# EAGLE design JTAG (EAGLE 6.5.0)
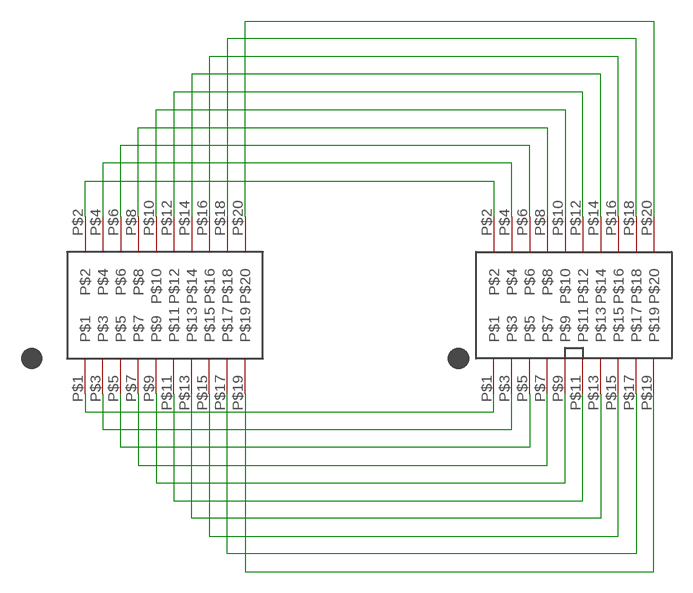
[diagram p0: schematic, sheet 1]

## Parts
U$1  MOLEX54722-0304  [MOLEX054722-0304]
U$2  2X10JTAG  [2X10JTAG]

## Nets
N$1: U$1.P$20 U$2.P$20
N$2: U$1.P$18 U$2.P$18
N$3: U$1.P$16 U$2.P$16
N$4: U$1.P$14 U$2.P$14
N$5: U$1.P$12 U$2.P$12
N$6: U$1.P$10 U$2.P$10
N$7: U$1.P$8 U$2.P$8
N$8: U$1.P$6 U$2.P$6
N$9: U$1.P$5 U$2.P$5
N$10: U$1.P$4 U$2.P$4
N$11: U$1.P$2 U$2.P$2
N$12: U$1.P$1 U$2.P$1
N$13: U$1.P$3 U$2.P$3
N$14: U$1.P$7 U$2.P$7
N$15: U$1.P$9 U$2.P$9
N$16: U$1.P$11 U$2.P$11
N$17: U$1.P$13 U$2.P$13
N$18: U$1.P$15 U$2.P$15
N$19: U$1.P$17 U$2.P$17
N$20: U$1.P$19 U$2.P$19

## Library data of the parts
U$1 = KW2:MOLEX54722-0304; MFGN: MOLEX; MFGP: 54722-0304
U$2 = KW2:2X10JTAG

## Board
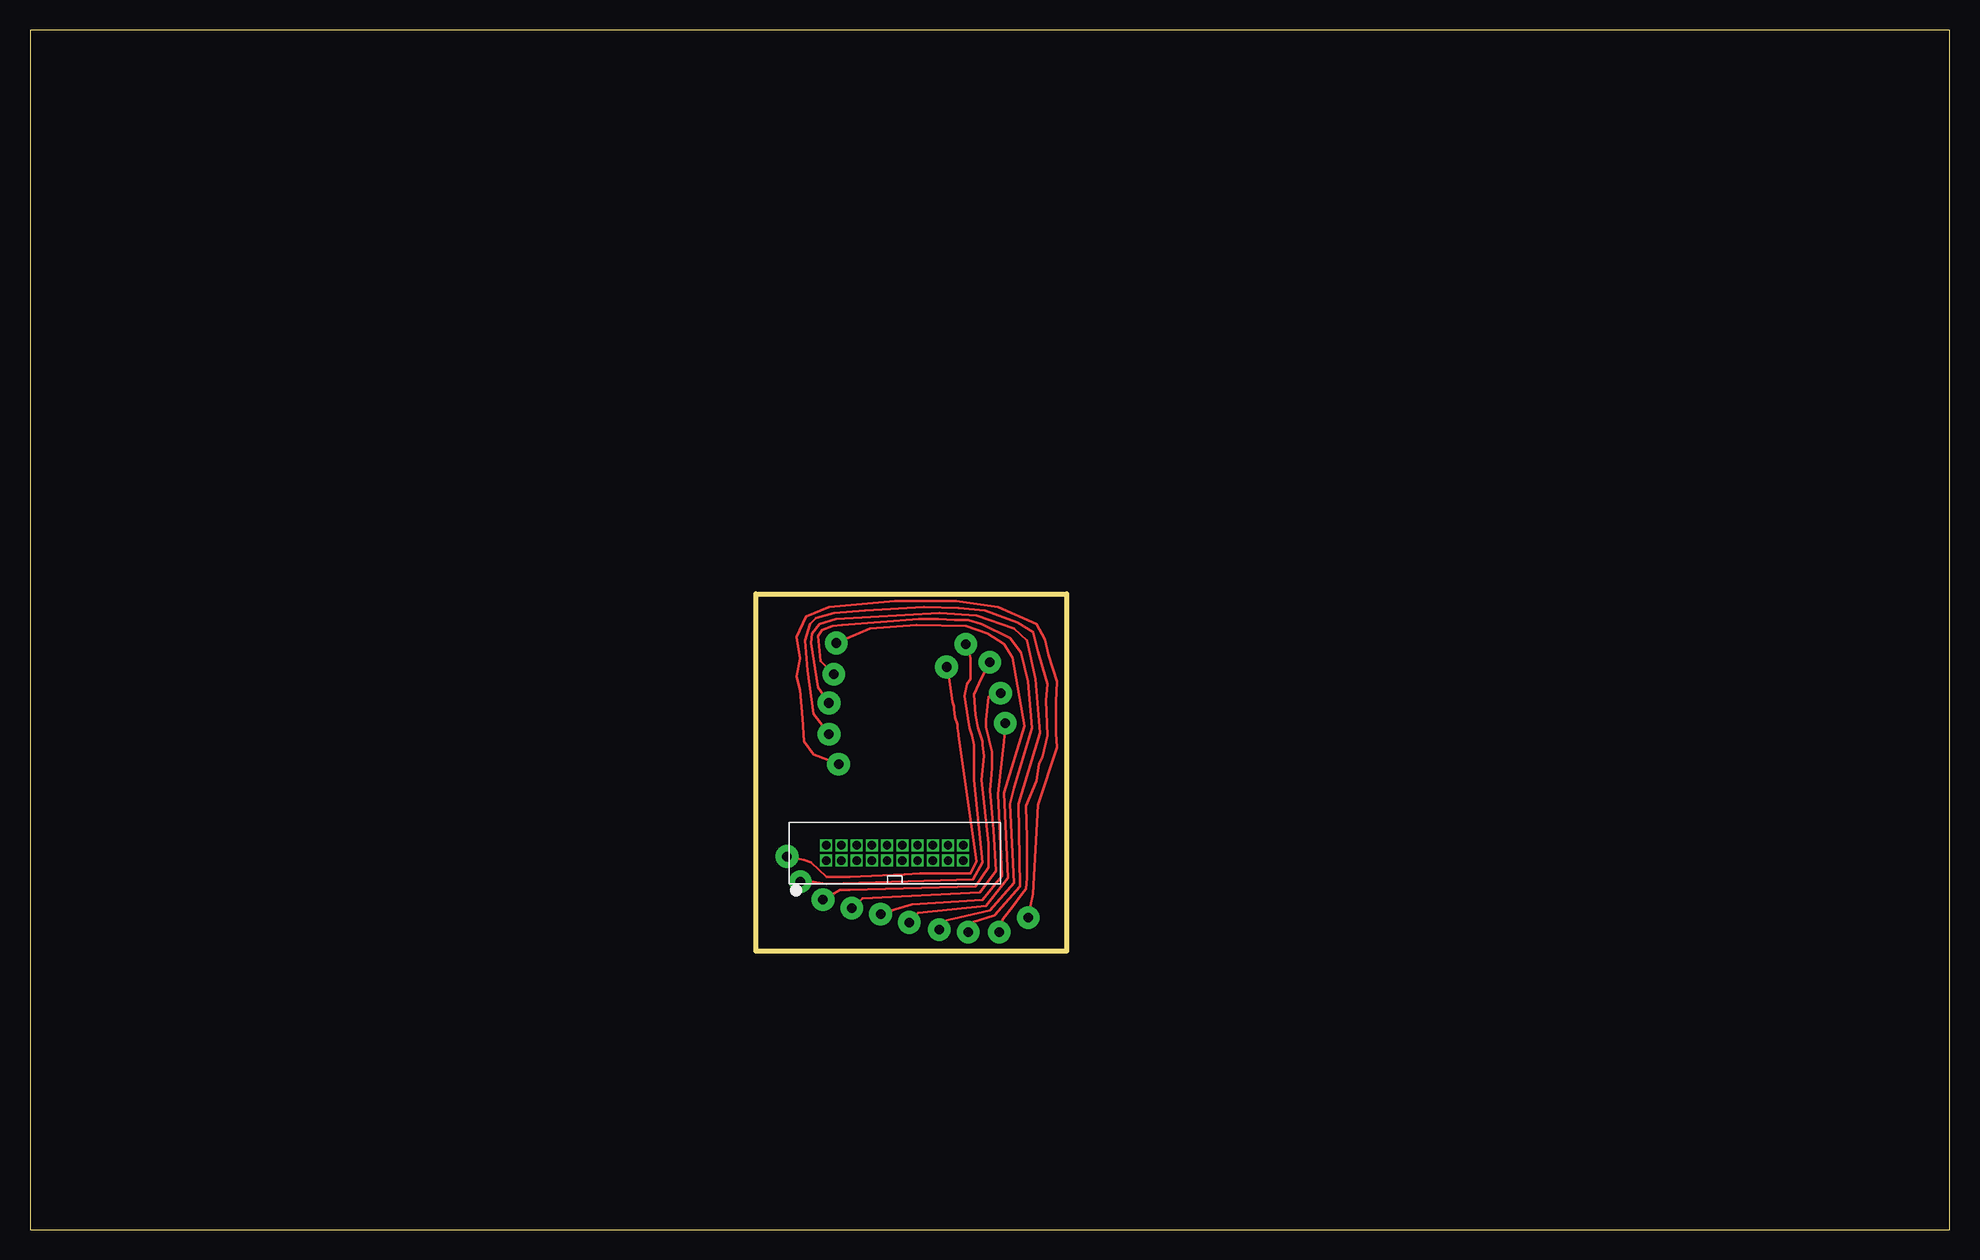
[diagram p1: board, top side]
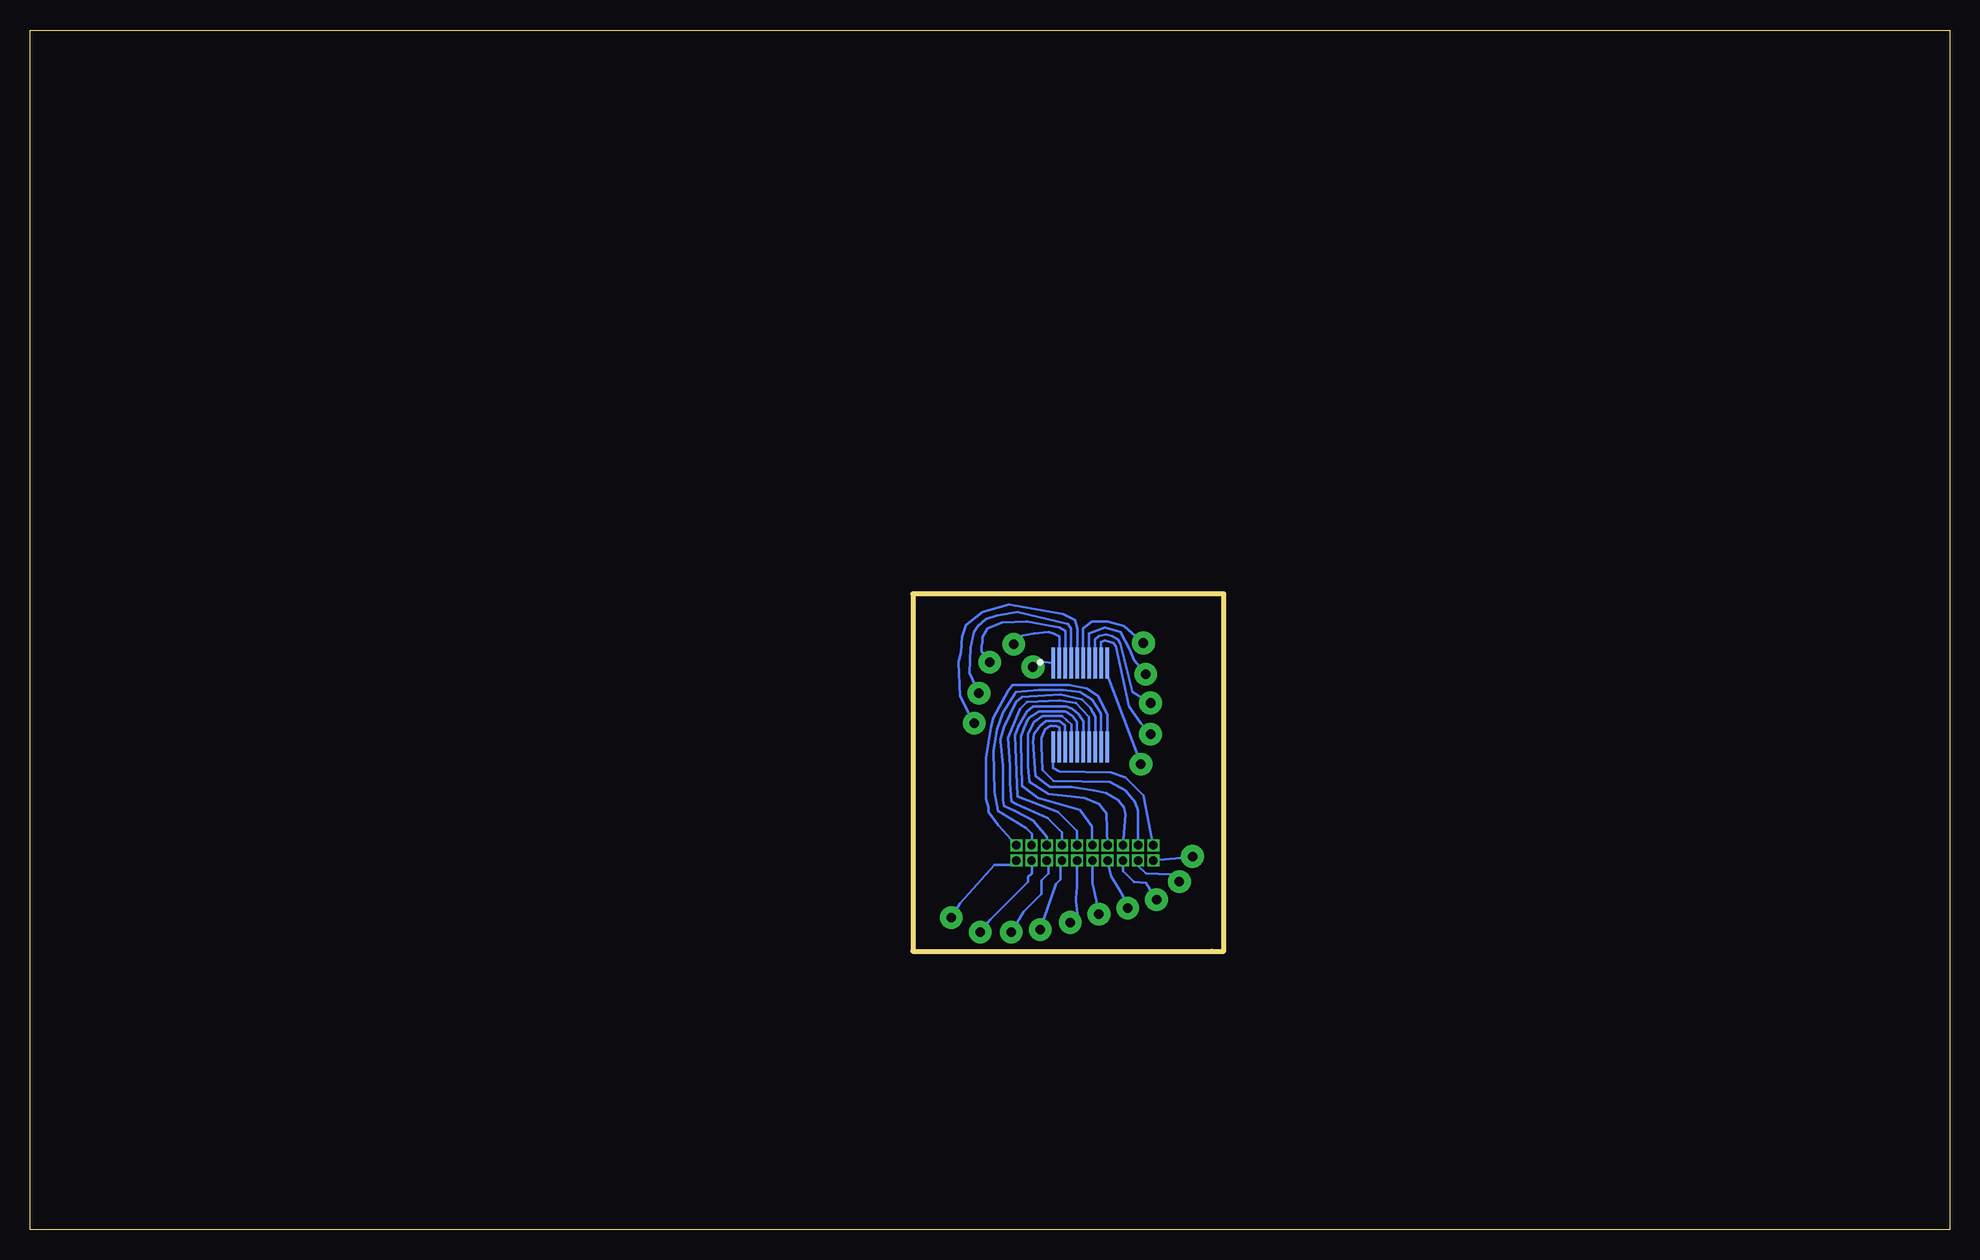
[diagram p2: board, bottom side, seen from below]

Size 160 x 100 mm. Coordinates in mm from the lower left corner, seen from the top.
Outline: 0,0 160,0 160,100 0,100 0,0
Outline: 60.5,53 86.4,53 86.4,23.2 61.5,23.2 60.5,23.2 60.5,53
Copper layers (1*16): Top 0.035mm / dielectric 1.5mm / Bottom 0.035mm
Design rules "default *": minimum track width 2mil, minimum drill 24mil, track to track 0.2mm, track to pad 0.2mm, pad to pad 0.2mm, via to via 0.2mm, smd to smd 0.2mm, copper to edge 40mil, drill to drill 8mil, minimum pad ring 1mil, minimum via ring 1mil, stop-mask expansion 4mil, vias tented up to drill 0mil, thermal gap 10mil

### Footprints (pad centres in the part's own frame; a part is rotated, then mirrored left to right if it is on the bottom)
MOLEX054722-0304 = smd 0.3 x 2.6: P$1 2.25,-3.5; P$2 2.25,3.5; P$3 1.75,-3.5; P$4 1.75,3.5; P$5 1.25,-3.5; P$6 1.25,3.5; P$7 0.75,-3.5; P$8 0.75,3.5; P$9 0.25,-3.5; P$10 0.25,3.5; P$11 -0.25,-3.5; P$12 -0.25,3.5; P$13 -0.75,-3.5; P$14 -0.75,3.5; P$15 -1.25,-3.5; P$16 -1.25,3.5; P$17 -1.75,-3.5; P$18 -1.75,3.5; P$19 -2.25,-3.5; P$20 -2.25,3.5
2X10JTAG = drill 0.7 pad 1 square: P$1 -6.35,-1.27; P$2 -6.35,0; P$3 -5.08,-1.27; P$4 -5.08,0; P$5 -3.81,-1.27; P$6 -3.81,0; P$7 -2.54,-1.27; P$8 -2.54,0; P$9 -1.27,-1.27; P$10 -1.27,0; P$11 0,-1.27; P$12 0,0; P$13 1.27,-1.27; P$14 1.27,0; P$15 2.54,-1.27; P$16 2.54,0; P$17 3.81,-1.27; P$18 3.81,0; P$19 5.08,-1.27; P$20 5.08,0

### Placement (x,y rotation side)
U$1  72.46,43.74 180 bottom
U$2  72.71,32.03 0 top

### Tracks (layer width: path | path; a pad name or v marks a point on that pad's centre or on a via)
N$1
  Bottom 0.2: U$2.P$20 79.33,33.73 80.1,34.8 80.1,35.2 80.3,35.9 80.3,36.5 80.3,37.8 80.3,39.3 79.9,41.9 79.7,42.7 78.5,44.9 78.1,45.4 73.4,45.4 71.9,45.1 71,44.5 70.2,42.95 U$1.P$20
N$2
  Bottom 0.2: U$1.P$18 70.71,43.01 71.5,44.2 72.5,44.8 73.9,45 74.9,45 75.9,45 77.8,44.8 78.9,43.1 79.4,41.7 79.7,39.9 79.6,36.5 79.3,34.9 77,33.5 76.5,33 76.5,32.05 U$2.P$18
N$3
  Bottom 0.2: U$2.P$16 75.25,32.75 76.4,34.1 77.9,34.9 78.8,35.3 78.9,35.8 78.9,38.1 78.9,38.7 79.1,40.7 79.1,40.9 79,41.3 78.8,41.9 77.8,44 77.3,44.4 74.1,44.6 72.3,44.2 71.6,43.5 71.2,42.75 U$1.P$16
N$4
  Bottom 0.2: U$1.P$14 71.71,42.71 72.8,43.9 74.2,44.1 76.9,44 77.5,43.4 78.1,41.9 78.5,41 78.3,38.7 78.3,37.2 78.2,35.7 77.8,35.5 75.2,34.3 74,33.1 74,32.05 U$2.P$14
N$5
  Bottom 0.2: U$2.P$12 72.71,33.21 74.3,34.8 77.7,36.1 77.9,41.2 77.6,42 76.9,43.2 76.4,43.6 73.6,43.6 73.1,43.4 72.6,43 72.2,42.35 U$1.P$12
N$6
  Bottom 0.2: U$1.P$10 72.71,42.31 73.1,42.8 73.7,43.2 74.4,43.2 75.9,43.2 76.7,42.7 76.9,42.4 77.2,41.7 77.4,41.1 77.4,40.6 77.3,37 76,36 72.5,35 71.5,33.6 71.5,32.09 U$2.P$10
N$7
  Bottom 0.2: U$2.P$8 70.27,34.67 70.9,35.5 72.1,36 75.1,36.3 76.7,37.3 76.8,38.6 76.8,41.3 76.3,42.3 75.6,42.8 74,42.8 73.6,42.5 73.2,42.1 73.2,41.85 U$1.P$8
N$8
  Bottom 0.2: U$1.P$6 73.71,42.01 74.2,42.4 75.3,42.4 75.8,42 76.3,41.3 76.4,40.7 76.2,37.8 75,36.9 73.2,36.9 71.3,36.6 70.3,36.4 69.3,35.8 68.8,35.2 68.7,34.6 U$2.P$6
N$9  (via drill 0.8 pad 1.9)
  Top 0.2: v66.1,27.5 67.5,28.3 68.3,28.3 78.8,28.6 79.9,30.2 79.9,32.2 79.3,37.5 79.5,39.5 79.4,40.4 79.4,40.7 79,41.8 78.8,42.9 78.7,44.6 79.3,46 v80,47.3
  Bottom 0.2: U$2.P$5 68.9,29.9 68,29 67,28.9 v66.1,27.5 | v80,47.3 80.7,48.2 80.7,48.6 80.6,49 80.6,49.4 80.2,50.1 79,50.6 76.9,50.7 74.2,50.2 73.7,49.9 73.7,49.45 U$1.P$5
N$10
  Bottom 0.2: U$2.P$4 67.63,34.93 67.9,35.63 68.7,36.6 70,37.3 74.7,37.4 75.6,38.3 75.7,40.3 75.7,41 75.4,41.7 75,42 74.5,42 74.2,41.85 U$1.P$4
N$11
  Bottom 0.2: U$2.P$2 66.4,32.07 67.2,36.2 68.7,37.7 69.9,38.1 74.2,38.2 74.71,38.49 U$1.P$2
N$12  (via drill 0.8 pad 1.9)
  Top 0.2: v63.1,31.1 64.5,30.8 65.1,30.6 66.4,29.4 68.3,29.4 72.9,29.6 74.2,29.7 78.4,29.7 78.9,30.7 77.4,41.2 77.4,41.3 77.3,41.8 77.3,42.1 77.1,42.7 77,43.4 77,43.6 76.9,44 76.5,46.6 76.5,46.7 v76.4,46.9
  Bottom 0.2: U$2.P$1 64.06,30.96 v63.1,31.1 | v76.4,46.9 76.1,47.1 75.47,47.3 U$1.P$1
N$13  (via drill 0.8 pad 1.9)
  Top 0.2: v64.2,29 65.3,29 66.4,28.8 78.6,29.2 79.4,30.6 78.7,37.5 78.7,40.4 78.5,41.2 78.3,41.8 78.2,42.6 77.9,44.5 78.1,45.5 78.4,45.9 78.4,47.6 78.3,48 v78,48.8
  Bottom 0.2: U$2.P$3 67.63,30.33 67,29.7 64.9,29.6 v64.2,29 | v78,48.8 77.5,49.5 76.3,49.7 75.1,49.8 74.7,49.7 74.2,49.45 U$1.P$3
N$14  (via drill 0.8 pad 1.9)
  Top 0.2: v80.9,44.7 79.9,44.4 79.7,42.5 79.7,41.9 80.2,39.8 80.2,38.5 80.1,37.5 80,36.6 80.3,33.3 80.5,29.9 79.2,28.1 69.4,27.6 v68.5,26.8
  Bottom 0.2: U$1.P$7 73.21,50.11 73.5,50.5 77.7,51.5 79.4,51.2 80.3,50.9 81,50.3 81.3,49.8 81.6,48.5 81.7,46.4 v80.9,44.7 | v68.5,26.8 68.7,27.1 68.9,27.8 69.2,28.3 69.9,29.5 70.2,30.73 U$2.P$7
N$15  (via drill 0.8 pad 1.9)
  Top 0.2: v70.9,26.3 72.1,26.7 73.5,27.1 79.4,27.5 81,29.5 80.7,36.3 81.2,40.7 v81.3,42.2
  Bottom 0.2: U$2.P$9 71.44,28.84 71.1,27.4 71.2,26.7 v70.9,26.3 | v81.3,42.2 82.5,44.5 82.6,47.3 82.4,48.1 82.3,49.4 82,50.4 80.6,51.5 78.4,52.1 73.9,51.3 72.9,50.8 72.7,50.05 U$1.P$9
N$16  (via drill 0.8 pad 1.9)
  Top 0.2: v73.3,25.6 74,26.4 79.7,27 81.5,29.3 81.2,36.4 82.9,42 81.9,47.7 81.2,48.8 79.8,49.7 78,50.3 73.9,50.4 70,50.1 v67.2,48.9
  Bottom 0.2: U$2.P$11 72.71,28.61 72.8,27.6 72.8,27.4 72.7,26.3 v73.3,25.6 | U$1.P$11 72.21,50.09 71.5,50.7 70.9,50.7 70.2,50.7 68.8,50.3 v67.2,48.9
N$17  (via drill 0.8 pad 1.9)
  Top 0.2: v67,46.3 65.9,47.4 65.7,49.5 66,50 66.9,50.3 67.7,50.4 74.1,50.9 75.7,50.9 77.1,50.8 78.2,50.8 79.3,50.5 81.7,49.3 82.6,48.1 83.2,45.7 83.5,41.8 82,36.8 81.7,35.5 82,28.9 80,26.6 76,25.7 v75.8,25
  Bottom 0.2: U$1.P$13 71.71,49.69 70.4,50.2 69.1,49.8 68.3,48.3 68,47.5 v67,46.3 | v75.8,25 74.5,28.8 74.1,29.2 74.1,30.64 U$2.P$13
N$18  (via drill 0.8 pad 1.9)
  Top 0.2: v66.6,43.9 65.7,45.2 65.1,48.9 65.2,49.7 65.8,50.5 67.2,50.9 75.8,51.4 78.9,51.2 82,50.1 83.1,49.1 83.8,45.9 84.2,41.4 82.4,35.5 82.5,28.6 80.4,26.2 78.5,25.6 v78.2,24.8
  Bottom 0.2: U$1.P$15 71.21,49.19 70.9,49.5 70.3,49.6 69.8,49.5 69.3,49.2 69.1,48.8 68.1,44.8 v66.6,43.9 | v78.2,24.8 77.2,26.5 75.7,28 75.7,29.1 75.1,29.7 75.1,30.61 U$2.P$15
N$19  (via drill 0.8 pad 1.9)
  Top 0.2: v66.6,41.3 65.3,43 64.8,46.6 64.6,49.1 65,50.5 65.5,51 67,51.4 69.6,51.6 74.5,51.9 77.4,51.8 79.6,51.6 82.3,50.6 83.6,49.8 84,48.2 84.4,46.9 84.8,45.5 84.7,44.1 84.8,41.2 84.4,39.4 84.1,38.8 83.9,37.4 83,35.3 83.1,32.6 83.1,30.9 83.1,29.3 83,28.4 82.7,28 81.9,26.9 81.1,25.9 v80.8,24.8
  Bottom 0.2: U$1.P$17 70.71,48.99 70.4,49.1 69.7,48.9 69.5,48.6 68.4,43.6 67.4,42.2 v66.6,41.3 | v80.8,24.8 80,25.8 76.8,29 76.8,29.4 76.5,29.7 76.5,30.74 U$2.P$17
N$20  (via drill 0.8 pad 1.9)
  Top 0.2: v67.4,38.8 65.3,39.6 64.5,40.7 64.4,42.6 64.2,45 63.9,46.1 64.2,47.6 63.9,49.4 64.7,51.1 66.6,51.9 72.1,52.4 77.2,52.4 80.7,51.9 83.9,50.5 84.6,49.2 84.9,47.9 85.6,45.7 85.5,44 85.5,41.4 85.6,40.2 84,35.4 83.6,28 v83.2,26
  Bottom 0.2: U$1.P$19 70.21,46.31 v67.4,38.8 | v83.2,26 82.5,27.2 79.6,30.4 78.15,30.4 U$2.P$19